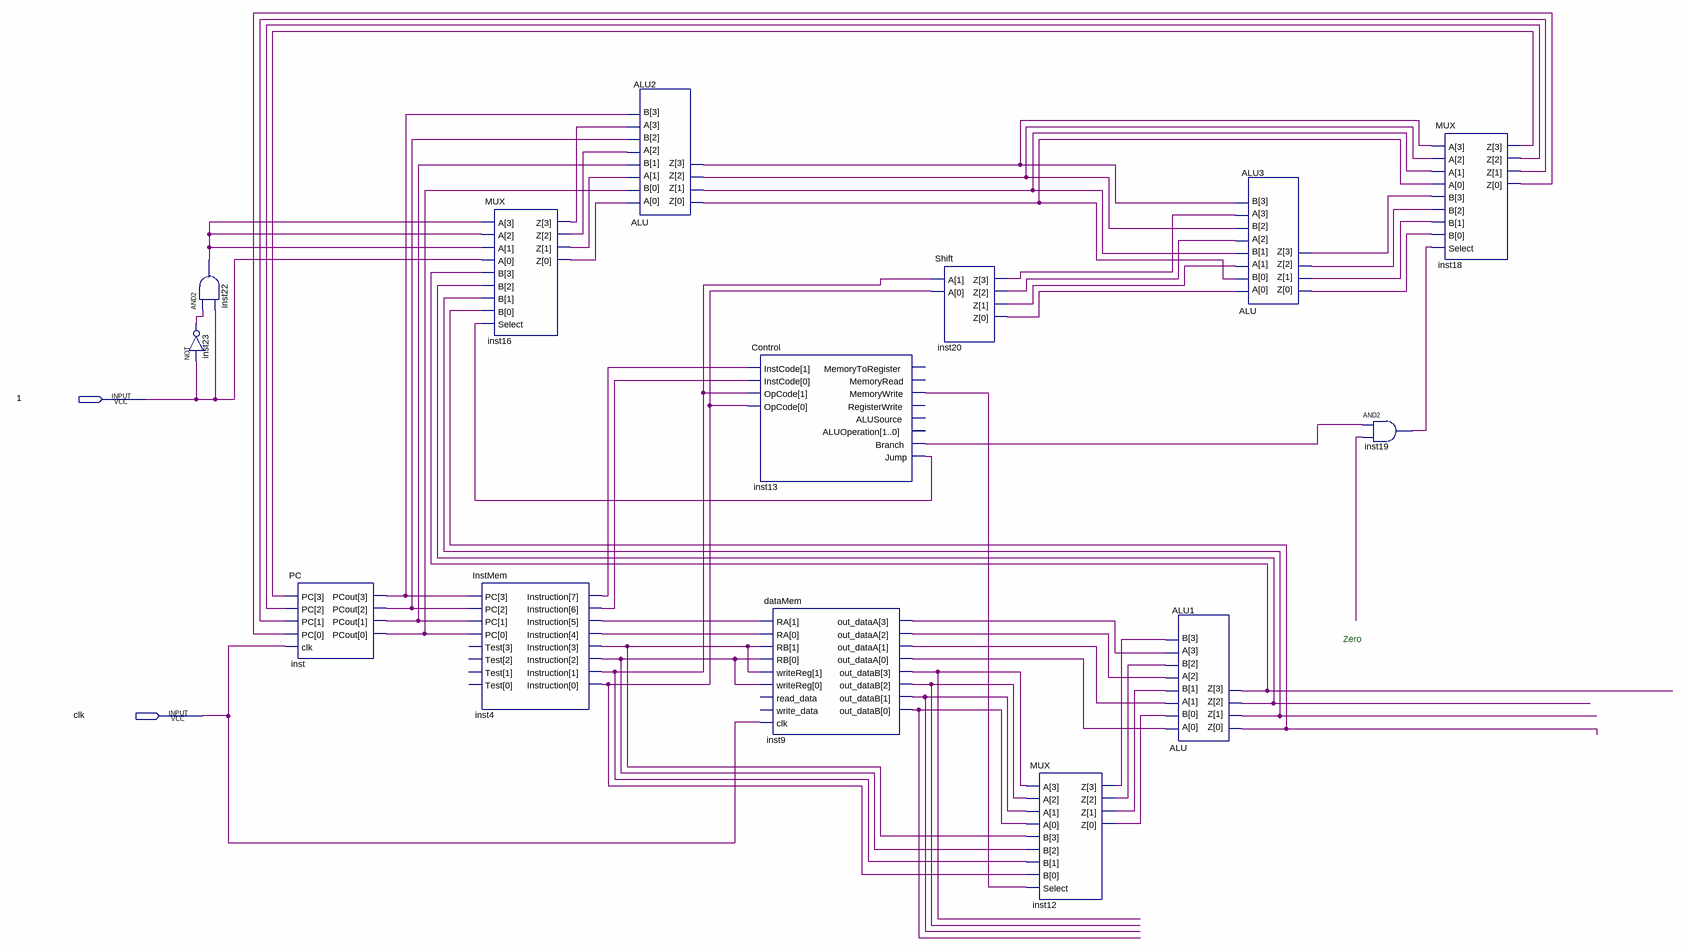
[diagram p0: schematic sheet]
// Quartus schematic KronosX.bdf as structural Verilog: 14 symbols, 2 pins
module KronosX (
  input  \1 ,
  input  clk
);

  wire ALU1_z, ALU1_z_2, ALU1_z_3, ALU1_z_4, ALU2_z, ALU2_z_2, ALU2_z_3, ALU2_z_4, ALU3_z, ALU3_z_2,
       ALU3_z_3, ALU3_z_4, inst4_instruction, inst4_instruction_2, inst4_instruction_3, inst4_instruction_4,
       inst4_instruction_5, inst4_instruction_6, inst4_instruction_7, inst4_instruction_8, inst9_out_dataa,
       inst9_out_dataa_2, inst9_out_dataa_3, inst9_out_dataa_4, inst9_out_datab, inst9_out_datab_2,
       inst9_out_datab_3, inst9_out_datab_4, inst12_z, inst12_z_2, inst12_z_3, inst12_z_4, inst13_branch,
       inst13_jump, inst13_memorywrite, inst16_z, inst16_z_2, inst16_z_3, inst16_z_4, inst18_z, inst18_z_2,
       inst18_z_3, inst18_z_4, inst19_out, inst20_z, inst20_z_2, inst20_z_3, inst20_z_4, inst22_out,
       inst23_out, inst_pcout, inst_pcout_2, inst_pcout_3, inst_pcout_4, undriven;

  and inst22 (inst22_out, inst23_out, \1 );
  not inst23 (inst23_out, \1 );
  PC inst (
    .PC({inst18_z, inst18_z_4, inst18_z_2, inst18_z_3}), .clk(clk),
    .PCout({inst_pcout_4, inst_pcout_3, inst_pcout_2, inst_pcout}));
  InstMem inst4 (
    .PC({inst_pcout_4, inst_pcout_3, inst_pcout_2, inst_pcout}),
    .Instruction({inst4_instruction_6, inst4_instruction_7, inst4_instruction, inst4_instruction_2, inst4_instruction_5, inst4_instruction_4, inst4_instruction_8, inst4_instruction_3}));  // open: Test
  MUX inst16 (
    .A({{3{inst22_out}}, \1 }), .B({ALU1_z_4, ALU1_z_3, ALU1_z_2, ALU1_z}), .Select(inst13_jump),
    .Z({inst16_z_4, inst16_z_3, inst16_z_2, inst16_z}));
  ALU ALU2 (
    .A({inst16_z_4, inst16_z_3, inst16_z_2, inst16_z}),
    .B({inst_pcout_4, inst_pcout_3, inst_pcout_2, inst_pcout}), .Z({ALU2_z, ALU2_z_2, ALU2_z_3, ALU2_z_4}));
  Control inst13 (
    .InstCode({inst4_instruction_6, inst4_instruction_7}),
    .OpCode({inst4_instruction_8, inst4_instruction_3}), .MemoryWrite(inst13_memorywrite),
    .Branch(inst13_branch), .Jump(inst13_jump));  // open: MemoryToRegister, MemoryRead, RegisterWrite, ALUSource, ALUOperation
  dataMem inst9 (
    .RA({inst4_instruction, inst4_instruction_2}), .RB({inst4_instruction_5, inst4_instruction_4}),
    .writeReg({inst4_instruction_5, inst4_instruction_4}), .clk(clk),
    .out_dataA({inst9_out_dataa, inst9_out_dataa_2, inst9_out_dataa_4, inst9_out_dataa_3}),
    .out_dataB({inst9_out_datab_4, inst9_out_datab_3, inst9_out_datab_2, inst9_out_datab}));  // open: read_data, write_data
  Shift inst20 (.A({inst4_instruction_8, inst4_instruction_3}), .Z({inst20_z_3, inst20_z, inst20_z_2, inst20_z_4}));
  MUX inst12 (
    .A({inst9_out_datab_4, inst9_out_datab_3, inst9_out_datab_2, inst9_out_datab}),
    .B({inst4_instruction_5, inst4_instruction_4, inst4_instruction_8, inst4_instruction_3}),
    .Select(inst13_memorywrite), .Z({inst12_z, inst12_z_4, inst12_z_2, inst12_z_3}));
  ALU ALU1 (
    .A({inst9_out_dataa, inst9_out_dataa_2, inst9_out_dataa_4, inst9_out_dataa_3}),
    .B({inst12_z, inst12_z_4, inst12_z_2, inst12_z_3}), .Z({ALU1_z_4, ALU1_z_3, ALU1_z_2, ALU1_z}));
  ALU ALU3 (
    .A({inst20_z_3, inst20_z, inst20_z_2, inst20_z_4}), .B({ALU2_z, ALU2_z_2, ALU2_z_3, ALU2_z_4}),
    .Z({ALU3_z_4, ALU3_z_3, ALU3_z_2, ALU3_z}));
  and inst19 (inst19_out, inst13_branch, undriven);
  MUX inst18 (
    .A({ALU2_z, ALU2_z_2, ALU2_z_3, ALU2_z_4}), .B({ALU3_z_4, ALU3_z_3, ALU3_z_2, ALU3_z}),
    .Select(inst19_out), .Z({inst18_z, inst18_z_4, inst18_z_2, inst18_z_3}));

  // Notes on the sheet:
  //   Zero
endmodule
